# EAGLE design pir_breakout (EAGLE 6.5.0)
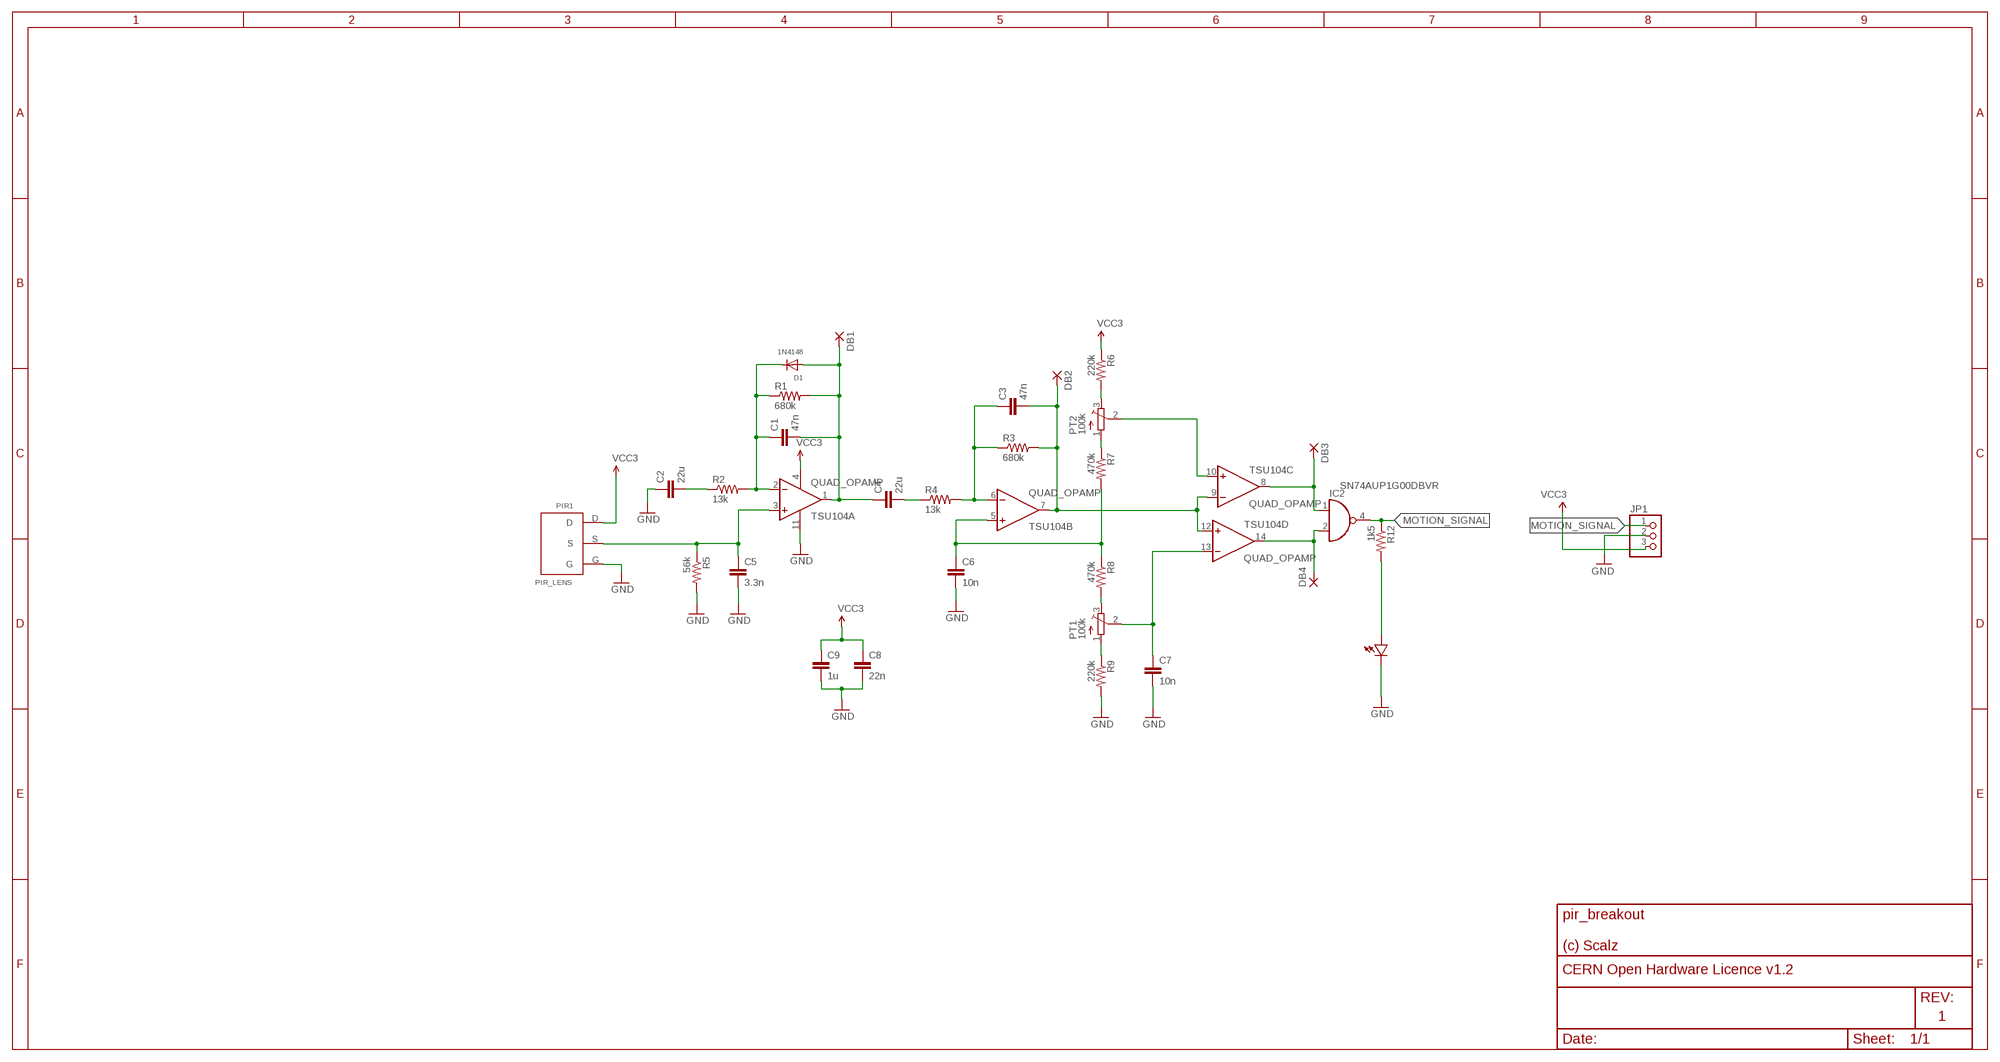
[diagram p0: schematic, sheet 1]

## Parts
C1  47n  CAP0805-CAP  [0805-CAP]
C2  22u  CAP0805-CAP  [0805-CAP]
C3  47n  CAP0805-CAP  [0805-CAP]
C4  22u  CAP0805-CAP  [0805-CAP]
C5  3.3n  CAP0805-CAP  [0805-CAP]
C6  10n  CAP0805-CAP  [0805-CAP]
C7  10n  CAP0805-CAP  [0805-CAP]
C8  22n  CAP0805-CAP  [0805-CAP]
C9  1u  CAP0805-CAP  [0805-CAP]
D1  1N4148  DIODESOD-123  [SOD-123]
D2  LED0805  [0805-LED]
DB1  1,6/0,8  [1,6/0,8]
DB2  1,6/0,8  [1,6/0,8]
DB3  1,6/0,8  [1,6/0,8]
DB4  1,6/0,8  [1,6/0,8]
IC2  SN74AUP1G00DBVR  74AHC1G00DBV  [SOT23-5]
JP1  PINHD-1X3  [1X03]
PIR1  PIR_LENS  [PIR_LENS]
PT1  100k  TRIMPOTTC33X  [TC33X]
PT2  100k  TRIMPOTTC33X  [TC33X]
R1  680k  RESISTOR0805-RES  [0805-RES]
R2  13k  RESISTOR0805-RES  [0805-RES]
R3  680k  RESISTOR0805-RES  [0805-RES]
R4  13k  RESISTOR0805-RES  [0805-RES]
R5  56k  RESISTOR0805-RES  [0805-RES]
R6  220k  RESISTOR0805-RES  [0805-RES]
R7  470k  RESISTOR0805-RES  [0805-RES]
R8  470k  RESISTOR0805-RES  [0805-RES]
R9  220k  RESISTOR0805-RES  [0805-RES]
R12  1k5  RESISTOR0805-RES  [0805-RES]
TSU104  QUAD_OPAMP  [TSSOP-14]

## Nets
GND: C2.1 C5.2 C6.2 C7.2 C8.2 C9.2 D2.MINUS JP1.2 PIR1.G R5.2 R9.2 TSU104.11(P:V-)
MOTION_SIGNAL: IC2.4(O) JP1.1 R12.1
N$1: C7.1 PT1.2(S) TSU104.13(D:-IN)
N$2: PT1.1(A) R9.1
N$3: C5.1 PIR1.S R5.1 TSU104.3(A:+IN)
N$4: PT1.3(E) R8.2
N$5: C1.1 D1.C R1.1 R2.2 TSU104.2(A:-IN)
N$6: C2.2 R2.1
N$7: C1.2 C4.1 D1.A DB1.1(P) R1.2 TSU104.1(A:OUT)
N$8: C4.2 R4.1
N$9: C3.1 R3.1 R4.2 TSU104.6(B:-IN)
N$10: C3.2 DB2.1(P) R3.2 TSU104.7(B:OUT) TSU104.9(C:-IN) TSU104.12(D:+IN)
N$11: DB3.1(P) IC2.1(I0) TSU104.8(C:OUT)
N$12: DB4.1(P) IC2.2(I1) TSU104.14(D:OUT)
N$13: PT2.2(S) TSU104.10(C:+IN)
N$14: PT2.3(E) R6.2
N$15: PT2.1(A) R7.1
N$16: D2.PLUS R12.2
N$17: C6.1 R7.2 R8.1 TSU104.5(B:+IN)
VCC: C8.1 C9.1 JP1.3 PIR1.D R6.1 TSU104.4(P:V+) ; supply symbol labelled VCC3

## Power pins joined to a net without a drawn wire
GND: IC2.3(GND)
VCC: IC2.5(VCC)

## Library data of the parts
C1-C9 = LowPowerLab:CAP: Capacitor Standard 0603 ceramic capacitor, and 0.1" leaded capacitor.
D1 = adafruit:DIODE: Diode SMADIODE - SMA Surface Mount Package 20V 1A Schottky Diode Digikey: 641-1014-6-ND DO-1N4148 - Through Hole Small Current Diode SOD-123 20V 1 A (.5mV Vf) Schottky Diode - Digikey: MBRX120TPMSCT-ND SOD-323 10V 570mA (.38mV Vf, 3ns) Schottky Diode - Digikey: ZLLS410CT-ND SOD-523 30V 30mA Schottky Diode (RB751S-40TE61) - Digikey: RB751S-40TE61CT-ND SOT23-R/W - SOT23 Package (R = Solder Paste/Reflow Ovens, W = Hand-Soldering) BAT54Film 40V 300mA - Digikey: 497-7162-1-ND
D2 = LowPowerLab:LED
DB1-DB4 = wirepad:1,6/0,8: THROUGH-HOLE PAD
IC2 = 74xx-little-de:74*1G00: 2-input NAND gate
JP1 = adafruit:PINHD-1X3: PIN HEADER
PIR1 = pmo_lib:PIR_LENS
PT1 PT2 = adafruit:TRIMPOT: SMT trimmer potentiometer part number TC33X http://www.ladyada.net/library/eagle
R1-R9 R12 = LowPowerLab:RESISTOR: Resistor Basic schematic elements and footprints for 0603, 1206, and PTH resistors.
TSU104 = pmo_lib:QUAD_OPAMP: OP AMP Standard quad package

## Board
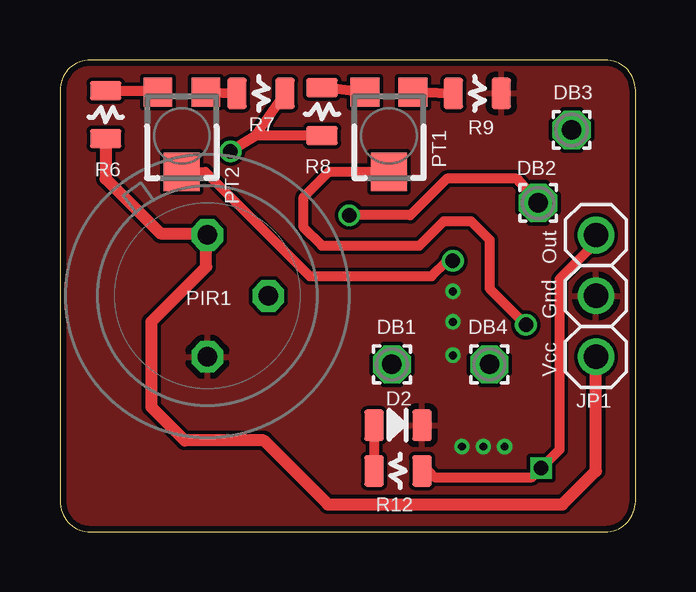
[diagram p1: board, top side]
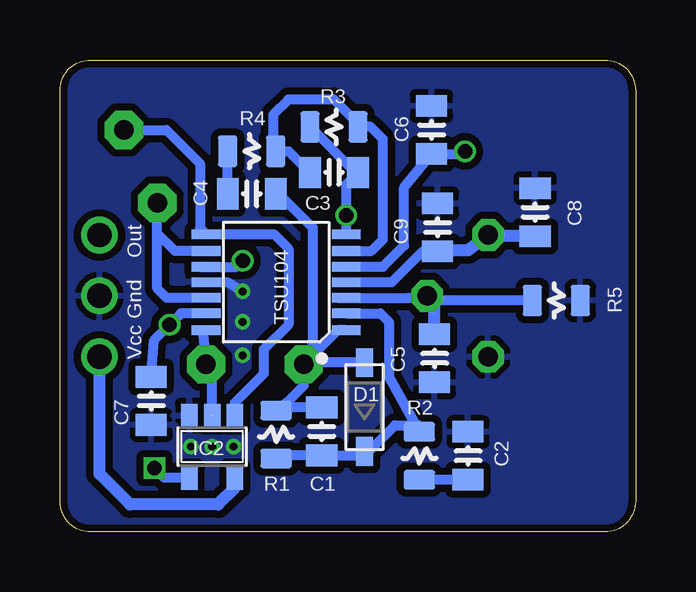
[diagram p2: board, bottom side, seen from below]

Size 24 x 19.68 mm. Coordinates in mm from the lower left corner, seen from the top.
Outline: 0,18.41 0,1.27 arc90 1.27,0 22.73,0 arc90 24,1.27 24,18.41 arc90 22.73,19.68 1.27,19.68 arc90 0,18.41
Copper layers (1*16): Top 0.035mm / dielectric 1.5mm / Bottom 0.035mm
Design rules "SeeedStudio_2layer_DRU_no_angle_20140221": minimum track width 6mil, minimum drill 12mil, track to track 6mil, track to pad 6mil, pad to pad 6mil, via to via 6mil, smd to smd 0mil, copper to edge 10mil, drill to drill 10mil, minimum pad ring 10mil, minimum via ring 6mil, stop-mask expansion 2mil, vias tented up to drill 100mil, thermal gap 10mil

### Footprints (pad centres in the part's own frame; a part is rotated, then mirrored left to right if it is on the bottom)
0805-CAP = smd 0.902 x 1.3: 1 -1,0; 2 1,0
SOD-123 = smd 1.2 x 0.7: A 1.85,0; C -1.85,0
0805-LED = smd 0.8 x 1.3: MINUS -1,0; PLUS 1,0
1,6/0,8 = drill 0.813 pad 1.6 octagon: 1 0,0
SOT23-5 = smd 0.69 x 0.99: 1 -0.95,-1.29; 2 0,-1.29; 3 0.95,-1.29; 4 0.95,1.3; 5 -0.95,1.3
1X03 = drill 1.016: 1 -2.54,0; 2 0,0; 3 2.54,0
PIR_LENS = drill 0.813 octagon: D 0,2.54; G 0,-2.54; S 2.54,0
TC33X = smd 1.2 x 1.2: 1 -1,-1.825; 3 1,-1.825 | smd 1.5 x 1.6: 2 0,1.5
0805-RES = smd 0.8 x 1.3: 1 -1,0; 2 1,0
TSSOP-14 = smd 0.4 x 1.2: 1 -2,-2.925; 2 -1.3,-2.925; 3 -0.65,-2.925; 4 0,-2.925; 5 0.65,-2.925; 6 1.3,-2.925; 7 2,-2.925; 8 2,2.925; 9 1.3,2.925; 10 0.65,2.925; 11 0,2.925; 12 -0.65,2.925; 13 -1.3,2.925; 14 -2,2.925

### Placement (x,y rotation side)
C1  13.08,4.19 90 bottom
C2  6.99,3.17 270 bottom
C3  12.57,14.99 0 bottom
C4  16,14.1 180 bottom
C5  8.38,7.24 270 bottom
C6  8.51,16.76 90 bottom
C7  20.19,5.46 270 bottom
C8  4.19,13.34 90 bottom
C9  8.26,12.7 90 bottom
D1  11.3,5.21 90 bottom
D2  14.1,4.45 180 top
DB1  13.84,6.99 0 top
DB2  19.94,13.72 0 top
DB3  21.34,16.76 0 top
DB4  17.91,6.99 0 top
IC2  17.65,3.56 180 bottom
JP1  22.35,9.84 270 top
PIR1  6.15,9.84 0 top
PT1  13.72,16.51 180 top
PT2  5.08,16.51 180 top
R1  14.99,4.06 90 bottom
R2  9.02,3.17 90 bottom
R3  12.57,16.89 180 bottom
R4  16,15.88 0 bottom
R5  3.3,9.65 0 bottom
R6  1.91,17.4 90 top
R7  8.38,18.29 0 top
R8  10.92,17.53 90 top
R9  17.4,18.29 0 top
R12  14.1,2.54 180 top
TSU104  14.99,10.41 90 bottom

### Tracks (layer width: path | path; a pad name or v marks a point on that pad's centre or on a via)
GND  (via drill 0.33 pad 0.64)
  Bottom 0.406: 17.4,10.41 17.02,10.41 v16.38,10.03
  other vias: 16.38,8.76 16.38,7.37 16.76,3.56 17.65,3.56 18.54,3.56
  pour Top: -1.27,21.59 25.4,21.59 25.4,-1.27 -1.27,-1.27
  pour Bottom (isolate 0.305): 0,20.32 24.13,20.32 24.13,0 0,0
MOTION_SIGNAL  (via drill 0.6)
  Top 0.406: JP1.1 22.03,11.75 20.83,10.54 20.83,3.43 v20.07,2.67 19.68,2.29 15.62,2.29 15.37,2.54 R12.1
  Bottom 0.406: IC2.4 19.66,2.26 v20.07,2.67
N$1  (via drill 0.6)
  Top 0.406: PT1.2 11.2,15.01 10.16,13.97 10.16,12.7 10.92,11.94 14.99,11.94 16,12.95 17.14,12.95 17.91,12.19 17.91,10.16 v19.43,8.64
  Bottom 0.406: C7.1 20.07,8 v19.43,8.64 18.95,9.11 TSU104.13
N$2
  Top 0.406: PT1.1 15.08,18.34 R9.1
N$3
  Bottom 0.406: 12.4,9.76 TSU104.3 9.45,9.76 PIR1.S 8.44,9.65 R5.1
  Bottom 0.508: C5.1 8.38,9.54 PIR1.S
N$4
  Top 0.406: R8.2 11.26,18.53 PT1.3
N$5
  Bottom 0.406: R1.1 14.35,3.19 C1.1 11.26,3.19 D1.C 11.12,3.36 10.03,4.45 9.03,4.45 R2.2 10.29,6.46 10.29,8.76 10.64,9.11 TSU104.2
N$6
  Bottom 0.406: C2.2 R2.1
N$7
  Bottom 0.406: TSU104.1 12.41,8.41 DB1.1 | 13.72,7.11 DB1.1 | C1.2 14.35,5.19 R1.2 14.48,5.46 13.84,6.1 DB1.1 | 13.53,6.68 DB1.1 | C4.1 14.86,14.1 13.46,12.7 13.46,7.37 DB1.1 | D1.A 13.77,7.06 DB1.1
N$8
  Bottom 0.406: C4.2 R4.1
N$9
  Bottom 0.406: TSU104.6 11.02,11.71 10.54,12.19 10.54,16.38 11.05,16.89 R3.1 11.57,17.03 12.57,18.03 14.48,18.03 15.11,17.4 15.11,15.99 R4.2 14.46,15.88 C3.1
N$10  (via drill 0.6)
  Top 0.406: DB2.1 19.05,14.73 16.13,14.73 14.61,13.21 v12.06,13.21
  Bottom 0.406: TSU104.12 19.54,9.76 19.94,10.16 19.94,12.45 | 19.94,12.45 DB2.1 | TSU104.9 19.21,11.71 19.94,12.45 | v12.06,13.2 12.06,14.5 C3.2 11.67,14.99 R3.2 | TSU104.7 v12.06,13.2 | v12.06,13.2 v12.06,13.21
N$11
  Bottom 0.406: DB3.1 19.56,16.76 18.16,15.37 18.16,12.66 TSU104.8 15.08,12.41 14.48,11.81 14.48,8.64 15.49,7.62 15.49,6.6 16.7,5.39 IC2.1
N$12
  Bottom 0.406: TSU104.14 18.06,8.41 DB4.1 17.65,6.6 IC2.2
N$13  (via drill 0.6)
  Top 0.406: PT2.2 6.07,15.01 10.41,10.67 15.49,10.67 16.13,11.3 v16.38,11.3
  Bottom 0.406: TSU104.10 18.16,11.05 16.64,11.05 v16.38,11.3
N$14
  Top 0.406: R6.2 4.02,18.4 PT2.3
N$15
  Top 0.406: PT2.1 6.07,18.34 R7.1
N$16
  Top 0.406: D2.PLUS R12.2
N$17  (via drill 0.6)
  Top 0.406: R7.2 8.11,16.49 v7.11,15.88 8.14,16.53 R8.1
  Bottom 0.406: TSU104.5 10.53,11.06 9.65,11.94 9.65,14.37 C6.1 7.22,15.76 v7.11,15.88
VCC
  Top 0.508: JP1.3 22.35,2.54 20.95,1.14 11.18,1.14 8.51,3.81 5.21,3.81 3.81,5.21 3.81,8.76 6.1,11.05 6.1,12.33 PIR1.D 6.29,12.45 4.19,12.45 1.91,14.73 R6.1
  Bottom 0.406: TSU104.4 10.16,10.41 8.89,11.68 8.27,11.68 C9.1 8.21,11.75 | IC2.5 16.7,1.84
  Bottom 0.508: 16.7,1.84 17.4,1.14 21.08,1.14 22.35,2.41 JP1.3 | C8.1 6.3,12.34 PIR1.D 6.99,11.75 8.21,11.75

### Text on the board
tPlace: Out | Gnd | Vcc
bPlace: Out | Gnd | Vcc